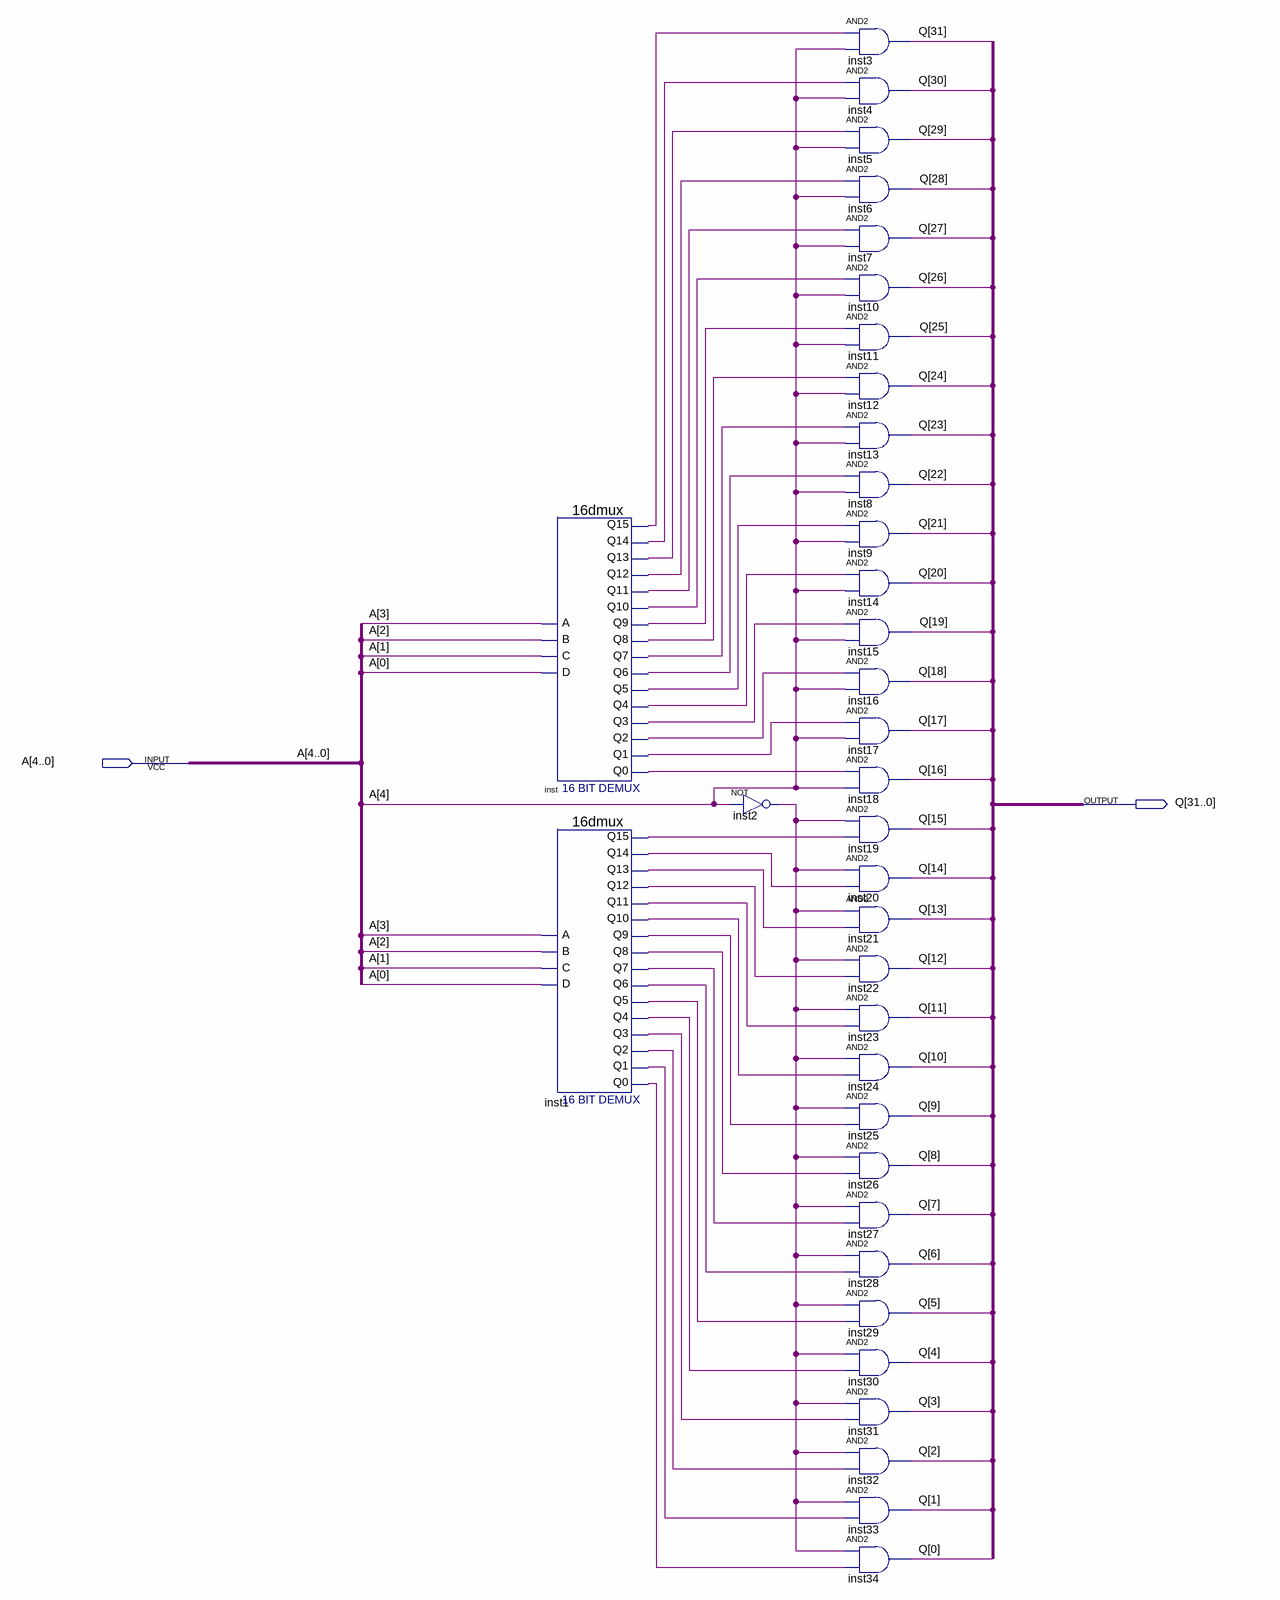
[diagram p0: schematic sheet]
// Quartus schematic 532decoder.bdf as structural Verilog: 35 symbols, 2 pins
module \532decoder  (
  input  [4:0] A,
  output [31:0] Q
);

  wire inst1_q0, inst1_q1, inst1_q2, inst1_q3, inst1_q4, inst1_q5, inst1_q6, inst1_q7, inst1_q8, inst1_q9,
       inst1_q10, inst1_q11, inst1_q12, inst1_q13, inst1_q14, inst1_q15, inst2_out, inst_q0, inst_q1,
       inst_q2, inst_q3, inst_q4, inst_q5, inst_q6, inst_q7, inst_q8, inst_q9, inst_q10, inst_q11, inst_q12,
       inst_q13, inst_q14, inst_q15;

  \16dmux  inst (
    .C(A[1]), .B(A[2]), .A(A[3]), .D(A[0]), .Q12(inst_q12), .Q13(inst_q13), .Q11(inst_q11), .Q9(inst_q9),
    .Q10(inst_q10), .Q7(inst_q7), .Q8(inst_q8), .Q4(inst_q4), .Q5(inst_q5), .Q6(inst_q6), .Q2(inst_q2),
    .Q3(inst_q3), .Q14(inst_q14), .Q15(inst_q15), .Q0(inst_q0), .Q1(inst_q1));
  \16dmux  inst1 (
    .C(A[1]), .B(A[2]), .A(A[3]), .D(A[0]), .Q12(inst1_q12), .Q13(inst1_q13), .Q11(inst1_q11), .Q9(inst1_q9),
    .Q10(inst1_q10), .Q7(inst1_q7), .Q8(inst1_q8), .Q4(inst1_q4), .Q5(inst1_q5), .Q6(inst1_q6),
    .Q2(inst1_q2), .Q3(inst1_q3), .Q14(inst1_q14), .Q15(inst1_q15), .Q0(inst1_q0), .Q1(inst1_q1));
  not inst2 (inst2_out, A[4]);
  and inst3 (Q[31], inst_q15, A[4]);
  and inst4 (Q[30], inst_q14, A[4]);
  and inst5 (Q[29], inst_q13, A[4]);
  and inst6 (Q[28], inst_q12, A[4]);
  and inst7 (Q[27], inst_q11, A[4]);
  and inst10 (Q[26], inst_q10, A[4]);
  and inst11 (Q[25], inst_q9, A[4]);
  and inst12 (Q[24], inst_q8, A[4]);
  and inst13 (Q[23], inst_q7, A[4]);
  and inst8 (Q[22], inst_q6, A[4]);
  and inst9 (Q[21], inst_q5, A[4]);
  and inst14 (Q[20], inst_q4, A[4]);
  and inst15 (Q[19], inst_q3, A[4]);
  and inst16 (Q[18], inst_q2, A[4]);
  and inst17 (Q[17], inst_q1, A[4]);
  and inst18 (Q[16], inst_q0, A[4]);
  and inst19 (Q[15], inst2_out, inst1_q15);
  and inst20 (Q[14], inst2_out, inst1_q14);
  and inst21 (Q[13], inst2_out, inst1_q13);
  and inst22 (Q[12], inst2_out, inst1_q12);
  and inst23 (Q[11], inst2_out, inst1_q11);
  and inst24 (Q[10], inst2_out, inst1_q10);
  and inst25 (Q[9], inst2_out, inst1_q9);
  and inst26 (Q[8], inst2_out, inst1_q8);
  and inst27 (Q[7], inst2_out, inst1_q7);
  and inst28 (Q[6], inst2_out, inst1_q6);
  and inst29 (Q[5], inst2_out, inst1_q5);
  and inst30 (Q[4], inst2_out, inst1_q4);
  and inst31 (Q[3], inst2_out, inst1_q3);
  and inst32 (Q[2], inst2_out, inst1_q2);
  and inst33 (Q[1], inst2_out, inst1_q1);
  and inst34 (Q[0], inst2_out, inst1_q0);
endmodule
